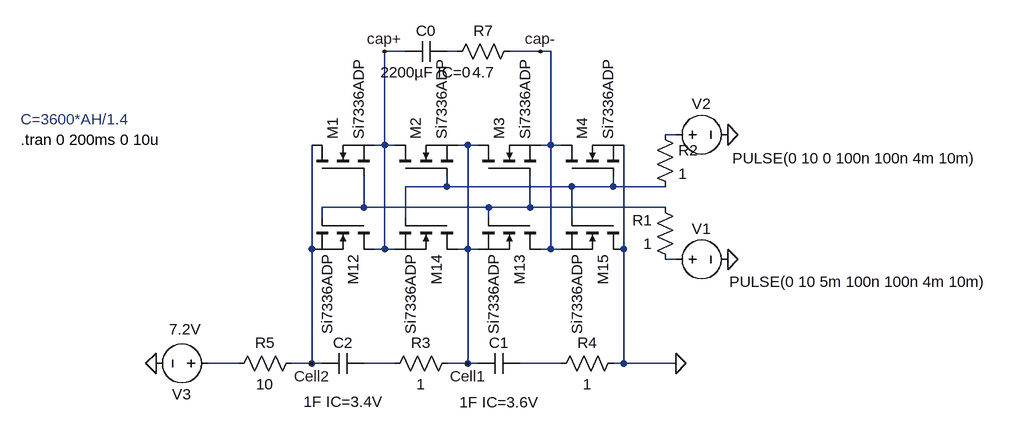
[diagram p0: schematic 2-cell.asc]
2-cell.asc, the LTspice schematic file:
Version 4
SHEET 1 2364 1024
WIRE 912 208 880 208
WIRE 992 208 976 208
WIRE 1120 208 1072 208
WIRE 1136 208 1120 208
WIRE 1328 336 1312 336
WIRE 880 352 880 208
WIRE 880 352 864 352
WIRE 896 352 880 352
WIRE 1008 352 992 352
WIRE 1024 352 1008 352
WIRE 1136 352 1136 208
WIRE 1136 352 1120 352
WIRE 1152 352 1136 352
WIRE 976 416 976 400
WIRE 976 416 912 416
WIRE 1168 416 976 416
WIRE 1232 416 1232 400
WIRE 1232 416 1168 416
WIRE 1312 416 1232 416
WIRE 848 448 848 400
WIRE 848 448 784 448
WIRE 1040 448 848 448
WIRE 1104 448 1104 400
WIRE 1104 448 1040 448
WIRE 1312 448 1104 448
WIRE 784 464 784 448
WIRE 912 464 912 416
WIRE 1040 464 1040 448
WIRE 1168 464 1168 416
WIRE 768 512 768 352
WIRE 880 512 880 352
WIRE 880 512 864 512
WIRE 896 512 880 512
WIRE 1008 512 1008 352
WIRE 1008 512 992 512
WIRE 1024 512 1008 512
WIRE 1136 512 1136 352
WIRE 1136 512 1120 512
WIRE 1152 512 1136 512
WIRE 1248 512 1248 352
WIRE 1328 528 1312 528
WIRE 656 688 608 688
WIRE 768 688 768 512
WIRE 768 688 736 688
WIRE 784 688 768 688
WIRE 896 688 848 688
WIRE 1008 688 1008 512
WIRE 1008 688 976 688
WIRE 1024 688 1008 688
WIRE 1152 688 1088 688
WIRE 1248 688 1248 512
WIRE 1248 688 1232 688
WIRE 1328 688 1248 688
FLAG 1408 336 0
FLAG 1408 528 0
FLAG 1328 688 0
FLAG 768 688 Cell2
FLAG 1008 688 Cell1
FLAG 880 208 cap+
FLAG 1120 208 cap-
FLAG 528 688 0
SYMBOL cap 976 224 M270
WINDOW 0 32 32 VTop 2
WINDOW 3 0 32 VBottom 2
SYMATTR InstName C0
SYMATTR Value 2200µF IC=0
SYMBOL cap 784 672 M90
WINDOW 0 0 32 VBottom 2
WINDOW 3 59 33 VTop 2
SYMATTR InstName C2
SYMATTR Value 1F IC=3.4V
SYMBOL res 992 672 R90
WINDOW 0 0 56 VBottom 2
WINDOW 3 32 56 VTop 2
SYMATTR InstName R3
SYMATTR Value 1
SYMBOL cap 1024 672 M90
WINDOW 0 0 32 VBottom 2
WINDOW 3 60 33 VTop 2
SYMATTR InstName C1
SYMATTR Value 1F IC=3.6V
SYMBOL res 1248 672 R90
WINDOW 0 0 56 VBottom 2
WINDOW 3 32 56 VTop 2
SYMATTR InstName R4
SYMATTR Value 1
SYMBOL voltage 1312 528 R270
WINDOW 0 32 56 VTop 2
WINDOW 3 -19 298 VBottom 2
WINDOW 123 0 0 Left 0
WINDOW 39 0 0 Left 0
SYMATTR InstName V1
SYMATTR Value PULSE(0 10 5m 100n 100n 4m 10m)
SYMBOL voltage 1312 336 R270
WINDOW 0 32 56 VTop 2
WINDOW 3 -21 292 VBottom 2
WINDOW 123 0 0 Left 0
WINDOW 39 0 0 Left 0
SYMATTR InstName V2
SYMATTR Value PULSE(0 10 0 100n 100n 4m 10m)
SYMBOL res 1088 192 R90
WINDOW 0 0 56 VBottom 2
WINDOW 3 32 56 VTop 2
SYMATTR InstName R7
SYMATTR Value 4.7
SYMBOL nmos 864 464 R90
SYMATTR InstName M12
SYMATTR Value Si7336ADP
SYMBOL nmos 1120 464 R90
SYMATTR InstName M13
SYMATTR Value Si7336ADP
SYMBOL nmos 992 464 R90
SYMATTR InstName M14
SYMATTR Value Si7336ADP
SYMBOL nmos 1248 464 R90
SYMATTR InstName M15
SYMATTR Value Si7336ADP
SYMBOL res 1328 544 R180
WINDOW 0 36 76 Left 2
WINDOW 3 36 40 Left 2
SYMATTR InstName R1
SYMATTR Value 1
SYMBOL res 1296 320 R0
SYMATTR InstName R2
SYMATTR Value 1
SYMBOL nmos 768 400 R270
SYMATTR InstName M1
SYMATTR Value Si7336ADP
SYMBOL nmos 896 400 R270
SYMATTR InstName M2
SYMATTR Value Si7336ADP
SYMBOL nmos 1024 400 R270
SYMATTR InstName M3
SYMATTR Value Si7336ADP
SYMBOL nmos 1152 400 R270
SYMATTR InstName M4
SYMATTR Value Si7336ADP
SYMBOL voltage 624 688 R90
WINDOW 0 32 56 VTop 2
WINDOW 3 -37 51 VBottom 2
WINDOW 123 0 0 Left 0
WINDOW 39 0 0 Left 0
SYMATTR InstName V3
SYMATTR Value 7.2V
SYMBOL res 640 704 R270
WINDOW 0 32 56 VTop 2
WINDOW 3 0 56 VBottom 2
SYMATTR InstName R5
SYMATTR Value 10
TEXT 320 312 Left 2 ;C=3600*AH/1.4
TEXT 320 344 Left 2 !.tran 0 200ms 0 10u

The netlist it stands for:
* 2-cell.asc
C0 N001 cap+ 2200µF IC=0
C2 Cell2 N007 1F IC=3.4V
R3 Cell1 N007 1
C1 Cell1 N008 1F IC=3.6V
R4 0 N008 1
V1 N005 0 PULSE(0 10 5m 100n 100n 4m 10m)
V2 N002 0 PULSE(0 10 0 100n 100n 4m 10m)
R7 cap- N001 4.7
M12 cap+ N004 Cell2 Cell2 Si7336ADP
M13 cap- N004 Cell1 Cell1 Si7336ADP
M14 Cell1 N003 cap+ cap+ Si7336ADP
M15 0 N003 cap- cap- Si7336ADP
R1 N005 N004 1
R2 N002 N003 1
M1 Cell2 N004 cap+ cap+ Si7336ADP
M2 cap+ N003 Cell1 Cell1 Si7336ADP
M3 Cell1 N004 cap- cap- Si7336ADP
M4 cap- N003 0 0 Si7336ADP
V3 N006 0 7.2V
R5 N006 Cell2 10
.model NMOS NMOS
.model PMOS PMOS
.lib standard.mos
* C=3600*AH/1.4
.tran 0 200ms 0 10u
.backanno
.end